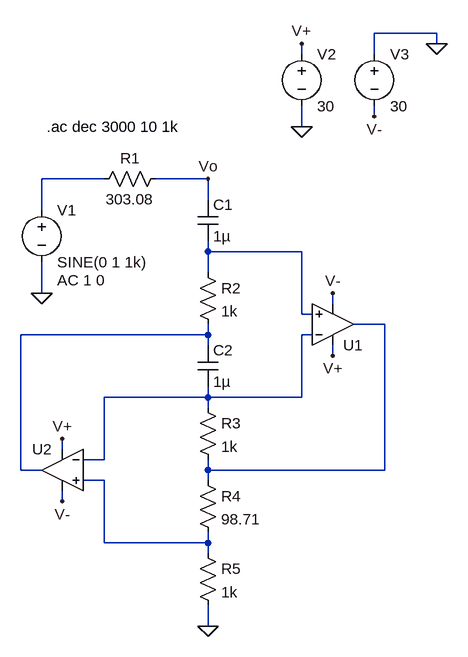
[diagram p0: schematic Ex9.asc]
Ex9.asc, the LTspice schematic file:
Version 4
SHEET 1 880 772
WIRE 656 -160 560 -160
WIRE 656 -144 656 -160
WIRE 448 -128 448 -144
WIRE 560 -128 560 -160
WIRE 560 -32 560 -48
WIRE 448 -16 448 -48
WIRE 144 64 48 64
WIRE 304 64 224 64
WIRE 304 96 304 64
WIRE 48 112 48 64
WIRE 304 176 304 160
WIRE 448 176 304 176
WIRE 304 208 304 176
WIRE 48 240 48 192
WIRE 496 256 496 240
WIRE 448 272 448 176
WIRE 464 272 448 272
WIRE 576 288 528 288
WIRE 304 304 304 288
WIRE 304 304 16 304
WIRE 464 304 448 304
WIRE 304 320 304 304
WIRE 496 336 496 320
WIRE 304 400 304 384
WIRE 304 400 144 400
WIRE 448 400 448 304
WIRE 448 400 304 400
WIRE 304 416 304 400
WIRE 80 480 80 464
WIRE 144 496 144 400
WIRE 144 496 112 496
WIRE 16 512 16 304
WIRE 48 512 16 512
WIRE 304 512 304 496
WIRE 576 512 576 288
WIRE 576 512 304 512
WIRE 144 528 112 528
WIRE 304 528 304 512
WIRE 80 560 80 544
WIRE 144 624 144 528
WIRE 304 624 304 608
WIRE 304 624 144 624
WIRE 304 640 304 624
WIRE 304 752 304 720
FLAG 48 240 0
FLAG 304 752 0
FLAG 448 -16 0
FLAG 656 -144 0
FLAG 448 -144 V+
FLAG 560 -32 V-
FLAG 496 240 V-
FLAG 80 560 V-
FLAG 496 336 V+
FLAG 80 464 V+
FLAG 304 64 Vo
SYMBOL voltage 48 96 R0
WINDOW 123 24 124 Left 2
WINDOW 39 0 0 Left 0
SYMATTR Value2 AC 1 0
SYMATTR InstName V1
SYMATTR Value SINE(0 1 1k)
SYMBOL res 240 48 R90
WINDOW 0 0 56 VBottom 2
WINDOW 3 32 56 VTop 2
SYMATTR InstName R1
SYMATTR Value 303.08
SYMBOL cap 288 96 R0
SYMATTR InstName C1
SYMATTR Value 1µ
SYMBOL res 288 192 R0
SYMATTR InstName R2
SYMATTR Value 1k
SYMBOL cap 288 320 R0
SYMATTR InstName C2
SYMATTR Value 1µ
SYMBOL res 288 400 R0
SYMATTR InstName R3
SYMATTR Value 1k
SYMBOL res 288 512 R0
SYMATTR InstName R4
SYMATTR Value 98.71
SYMBOL res 288 624 R0
SYMATTR InstName R5
SYMATTR Value 1k
SYMBOL OpAmps\\UniversalOpAmp 496 288 M180
SYMATTR InstName U1
SYMATTR Value2 Avol=1000000Meg GBW=10000000Meg Vos=0
SYMATTR SpiceLine En=0 Enk=0 In=0 Ink=0 Rin=500000000Meg
SYMBOL OpAmps\\UniversalOpAmp 80 512 M0
SYMATTR InstName U2
SYMATTR Value2 Avol=1000000Meg GBW=10000000Meg Vos=0
SYMATTR SpiceLine En=0 Enk=0 In=0 Ink=0 Rin=500000000Meg
SYMBOL voltage 448 -144 R0
WINDOW 123 0 0 Left 0
WINDOW 39 0 0 Left 0
SYMATTR InstName V2
SYMATTR Value 30
SYMBOL voltage 560 -144 R0
WINDOW 123 0 0 Left 0
WINDOW 39 0 0 Left 0
SYMATTR InstName V3
SYMATTR Value 30
TEXT 56 -16 Left 2 !.ac dec 3000 10 1k

The netlist it stands for:
* Ex9.asc
V1 N001 0 SINE(0 1 1k) AC 1 0
R1 Vo N001 303.08
C1 Vo N002 1µ
R2 N002 N004 1k
C2 N004 N005 1µ
R3 N005 N003 1k
R4 N003 N006 98.71
R5 N006 0 1k
XU1 N002 N005 V+ V- N003 level1 Avol=1000000Meg GBW=10000000Meg Vos=0 En=0 Enk=0 In=0 Ink=0 Rin=500000000Meg  ; pins In+ In- V+ V- OUT
XU2 N006 N005 V+ V- N004 level1 Avol=1000000Meg GBW=10000000Meg Vos=0 En=0 Enk=0 In=0 Ink=0 Rin=500000000Meg  ; pins In+ In- V+ V- OUT
V2 V+ 0 30
V3 0 V- 30
.ac dec 3000 10 1k
.lib UniversalOpAmp1.lib
.backanno
.end